# EAGLE design crass (EAGLE 7.3.0)
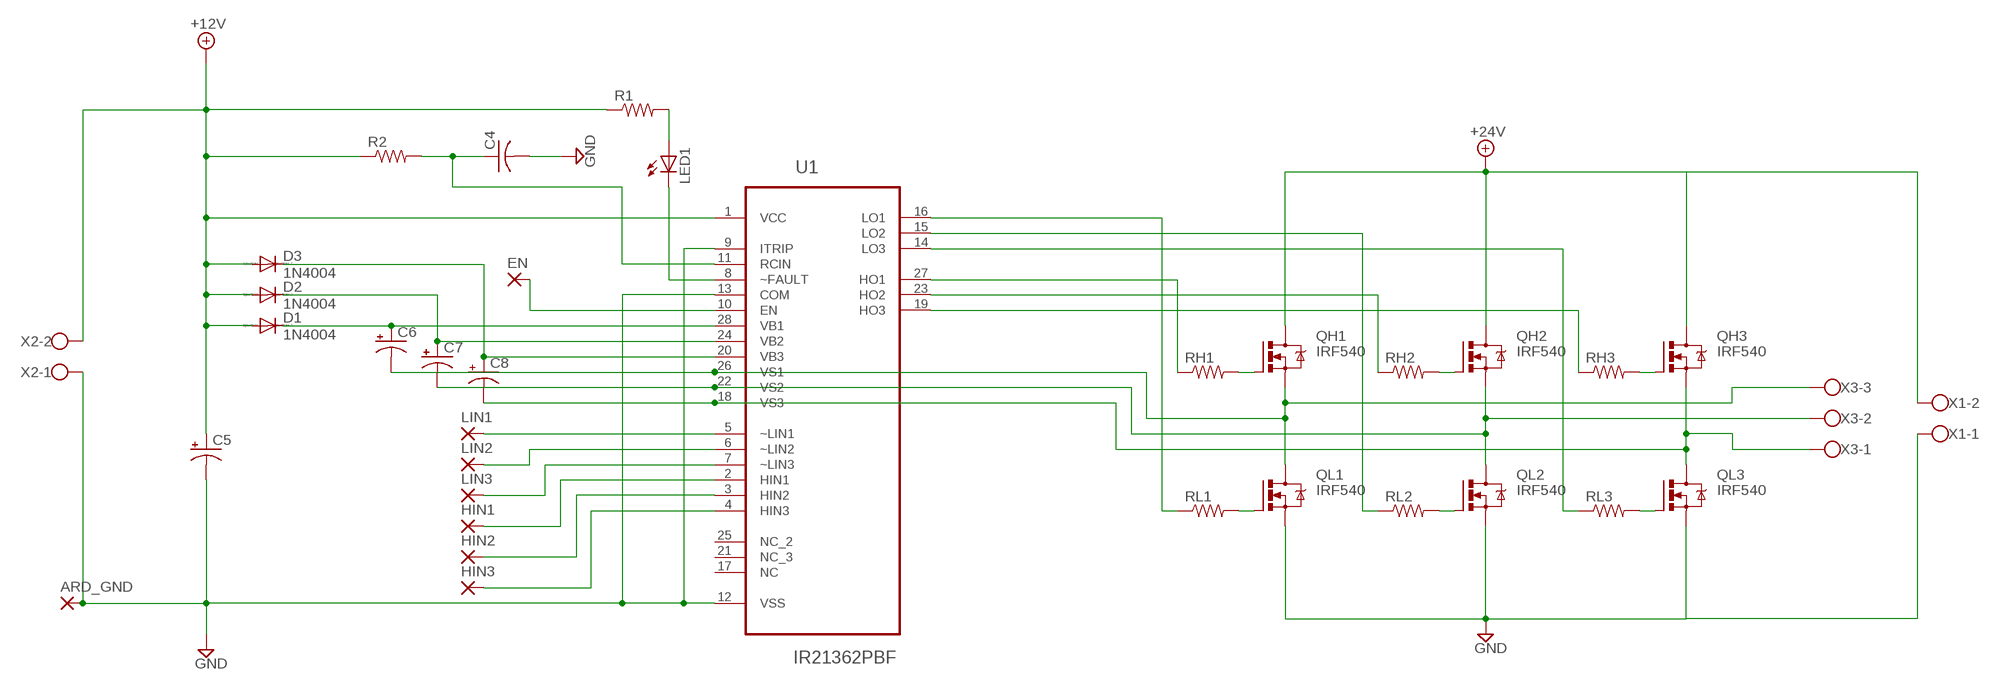
[diagram p0: schematic, sheet 1]

## Parts
ARD_GND  2,54/1,0  [2,54/1,0]
C4  C-US025-025X050  [C025-025X050]
C5  CPOL-USE2.5-7  [E2,5-7]
C6  CPOL-USE2.5-5  [E2,5-5]
C7  CPOL-USE2.5-5  [E2,5-5]
C8  CPOL-USE2.5-5  [E2,5-5]
D1  1N4004  [DO41-10]
D2  1N4004  [DO41-10]
D3  1N4004  [DO41-10]
EN  2,54/1,0  [2,54/1,0]
HIN1  2,54/1,0  [2,54/1,0]
HIN2  2,54/1,0  [2,54/1,0]
HIN3  2,54/1,0  [2,54/1,0]
LED1  LED5MM  [LED5MM]
LIN1  2,54/1,0  [2,54/1,0]
LIN2  2,54/1,0  [2,54/1,0]
LIN3  2,54/1,0  [2,54/1,0]
QH1  IRF540  [TO220BV]
QH2  IRF540  [TO220BV]
QH3  IRF540  [TO220BV]
QL1  IRF540  [TO220BV]
QL2  IRF540  [TO220BV]
QL3  IRF540  [TO220BV]
R1  R-US_0204/7  [0204/7]
R2  R-US_0204/7  [0204/7]
RH1  R-US_0204/7  [0204/7]
RH2  R-US_0204/7  [0204/7]
RH3  R-US_0204/7  [0204/7]
RL1  R-US_0204/7  [0204/7]
RL2  R-US_0204/7  [0204/7]
RL3  R-US_0204/7  [0204/7]
U1  IR21362PBF  [DIP254P1524X635-28]
X1  W237-102  [W237-102]
X2  W237-102  [W237-102]
X3  W237-103  [W237-103]

## Nets
+12V: C5.+ D1.A D2.A D3.A R1.1 R2.1 U1.1(VCC) X2.2
+24V: QH1.D QH2.D QH3.D X1.2
GND: ARD_GND.1(P) C4.2 C5.- QL1.S QL2.S QL3.S U1.9(ITRIP) U1.12(VSS) U1.13(COM) X1.1 X2.1
LIN2: LIN1.1(P) U1.5(~LIN1)
N$1: C6.+ D1.C U1.28(VB1)
N$2: C6.- QH1.S QL1.D U1.26(VS1) X3.3
N$3: C7.+ D2.C U1.24(VB2)
N$4: C7.- QH2.S QL2.D U1.22(VS2) X3.2
N$5: C8.+ D3.C U1.20(VB3)
N$6: C8.- QH3.S QL3.D U1.18(VS3) X3.1
N$7: QH1.G RH1.2
N$8: LED1.A R1.2
N$9: LED1.K(C) U1.8(~FAULT)
N$10: C4.1 R2.2 U1.11(RCIN)
N$11: QL1.G RL1.2
N$12: QH2.G RH2.2
N$13: QL2.G RL2.2
N$14: QH3.G RH3.2
N$15: QL3.G RL3.2
N$16: RH1.1 U1.27(HO1)
N$17: RL1.1 U1.16(LO1)
N$18: RH2.1 U1.23(HO2)
N$19: RH3.1 U1.19(HO3)
N$20: RL2.1 U1.15(LO2)
N$21: RL3.1 U1.14(LO3)
N$22: EN.1(P) U1.10(EN)
N$23: LIN2.1(P) U1.6(~LIN2)
N$24: LIN3.1(P) U1.7(~LIN3)
N$25: HIN1.1(P) U1.2(HIN1)
N$26: HIN2.1(P) U1.3(HIN2)
N$27: HIN3.1(P) U1.4(HIN3)
Unconnected: U1.17(NC) U1.21(NC_3) U1.25(NC_2)

## Library data of the parts
ARD_GND EN HIN1-HIN3 LIN1-LIN3 = wirepad:2,54/1,0: THROUGH-HOLE PAD
C4 = rcl:C-US: CAPACITOR, American symbol
C5-C8 = rcl:CPOL-US: POLARIZED CAPACITOR, American symbol
D1-D3 = diode:1N4004: DIODE general purpose rectifier, 1 A
LED1 = led:LED: LED OSRAM: - CHIPLED LG R971, LG N971, LY N971, LG Q971, LY Q971, LO R971, LY R971 LH N974, LH R974 LS Q976, LO Q976, LY Q976 LO Q996 - Hyper CHIPLED LW Q18S LB Q993, LB Q99A, LB R99A - SideLED LS A670, LO A670, LY A670, LG A670, LP A670 LB A673, LV A673, LT A673, LW A673 LH A674 LY A675 LS A676, LA A676, LO A676, LY A676, LW A676 LS A679, LY A679, LG A679 - Hyper Micro SIDELED® LS Y876, LA Y876, LO Y876, LY Y876 LT Y87S - SmartLED LW L88C, LW L88S LB L89C, LB L89S, LG L890 LS L89K, LO L89K, LY L89K LS L896, LA L896, LO L896, LY L896 - TOPLED LS T670, LO T670, LY T670, LG T670, LP T670 LSG T670, LSP T670, LSY T670, LOP T670, LYG T670 LG T671, LOG T671, LSG T671 LB T673, LV T673, LT T673, LW T673 LH T674 LS T676, LA T676, LO T676, LY T676, LB T676, LH T676, LSB T676, LW T676 LB T67C, LV T67C, LT T67C, LS T67K, LO T67K, LY T67K, LW E67C LS E67B, LA E67B, LO E67B, LY E67B, LB E67C, LV E67C, LT E67C LW T67C LS T679, LY T679, LG T679 LS T770, LO T770, LY T770, LG T770, LP T770 LB T773, LV T773, LT T773, LW T773 LH T774 LS E675, LA E675, LY E675, LS T675 LS T776, LA T776, LO T776, LY T776, LB T776 LHGB T686 LT T68C, LB T68C - Hyper Mini TOPLED® LB M676 - Mini TOPLED Santana® LG M470 LS M47K, LO M47K, LY M47K Source: http://www.osram.convergy.de LUXEON: - LUMILED® LXK2-PW12-R00, LXK2-PW12-S00, LXK2-PW14-U00, LXK2-PW14-V00 LXK2-PM12-R00, LXK2-PM12-S00, LXK2-PM14-U00 LXK2-PE12-Q00, LXK2-PE12-R00, LXK2-PE12-S00, LXK2-PE14-T00, LXK2-PE14-U00 LXK2-PB12-K00, LXK2-PB12-L00, LXK2-PB12-M00, LXK2-PB14-N00, LXK2-PB14-P00, LXK2-PB14-Q00 LXK2-PR12-L00, LXK2-PR12-M00, LXK2-PR14-Q00, LXK2-PR14-R00 LXK2-PD12-Q00, LXK2-PD12-R00, LXK2-PD12-S00 LXK2-PH12-R00, LXK2-PH12-S00 LXK2-PL12-P00, LXK2-PL12-Q00, LXK2-PL12-R00 Source: www.luxeon.com KINGBRIGHT: KA-3528ASYC Source: www.kingbright.com
QH1-QH3 QL1-QL3 = transistor-power:IRF540: HEXFET Power MOSFET
R1 R2 RH1-RH3 RL1-RL3 = rcl:R-US_: RESISTOR, American symbol
U1 = IR21362PBF:IR21362PBF: 3-PHASE BRIDGE DRIVER; MPN: IR21362PBF; OC_FARNELL: 1023217; OC_NEWARK: 33K5196; PACKAGE: PDIP-28; SUPPLIER: INTERNATIONAL RECTIFIER
X1 X2 = con-wago-500:W237-102: WAGO SCREW CLAMP; MPN: 237-102; OC_FARNELL: unknown; OC_NEWARK: 70K9898
X3 = con-wago-500:W237-103: WAGO SCREW CLAMP; MPN: 237-103; OC_FARNELL: unknown; OC_NEWARK: 18M7116

## Board
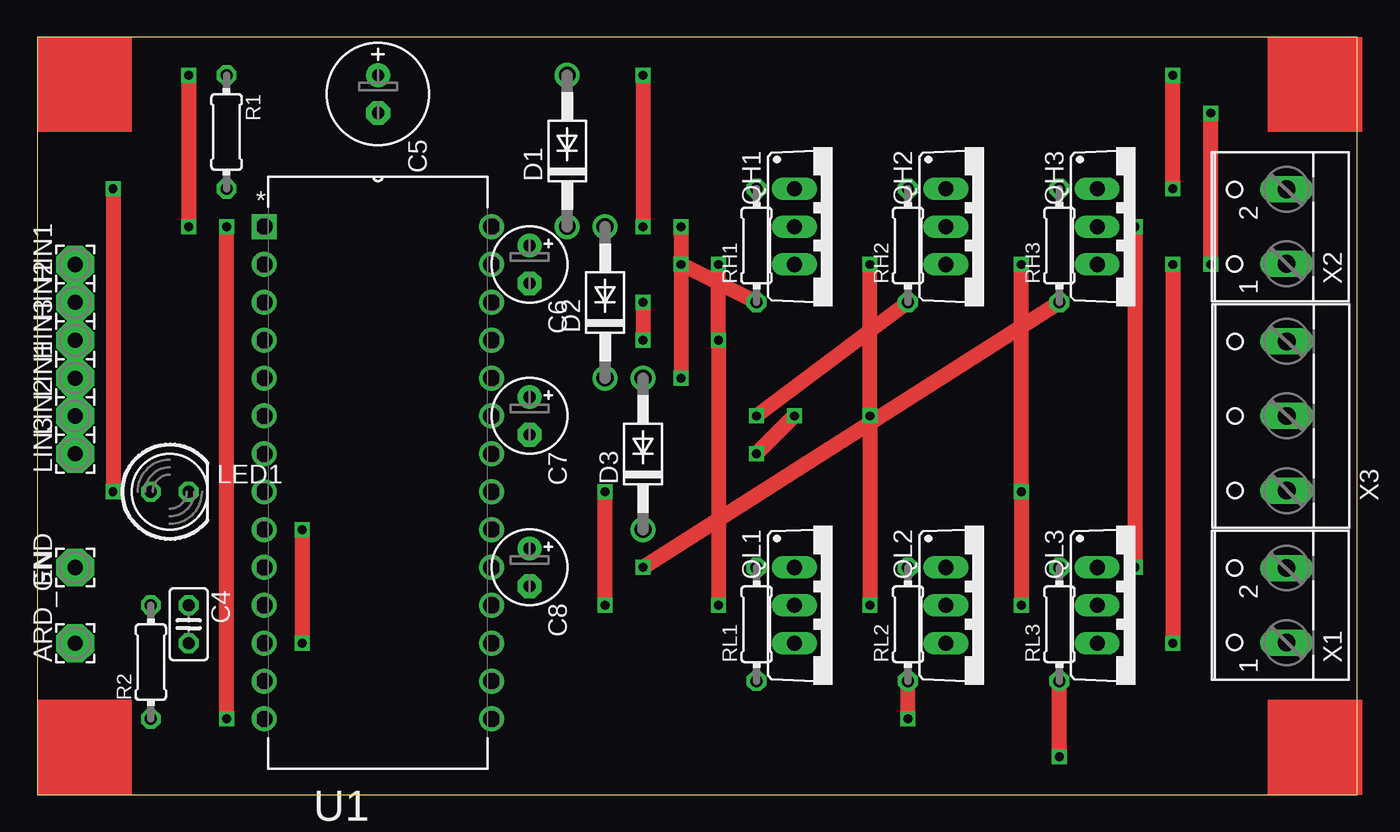
[diagram p1: board, top side]
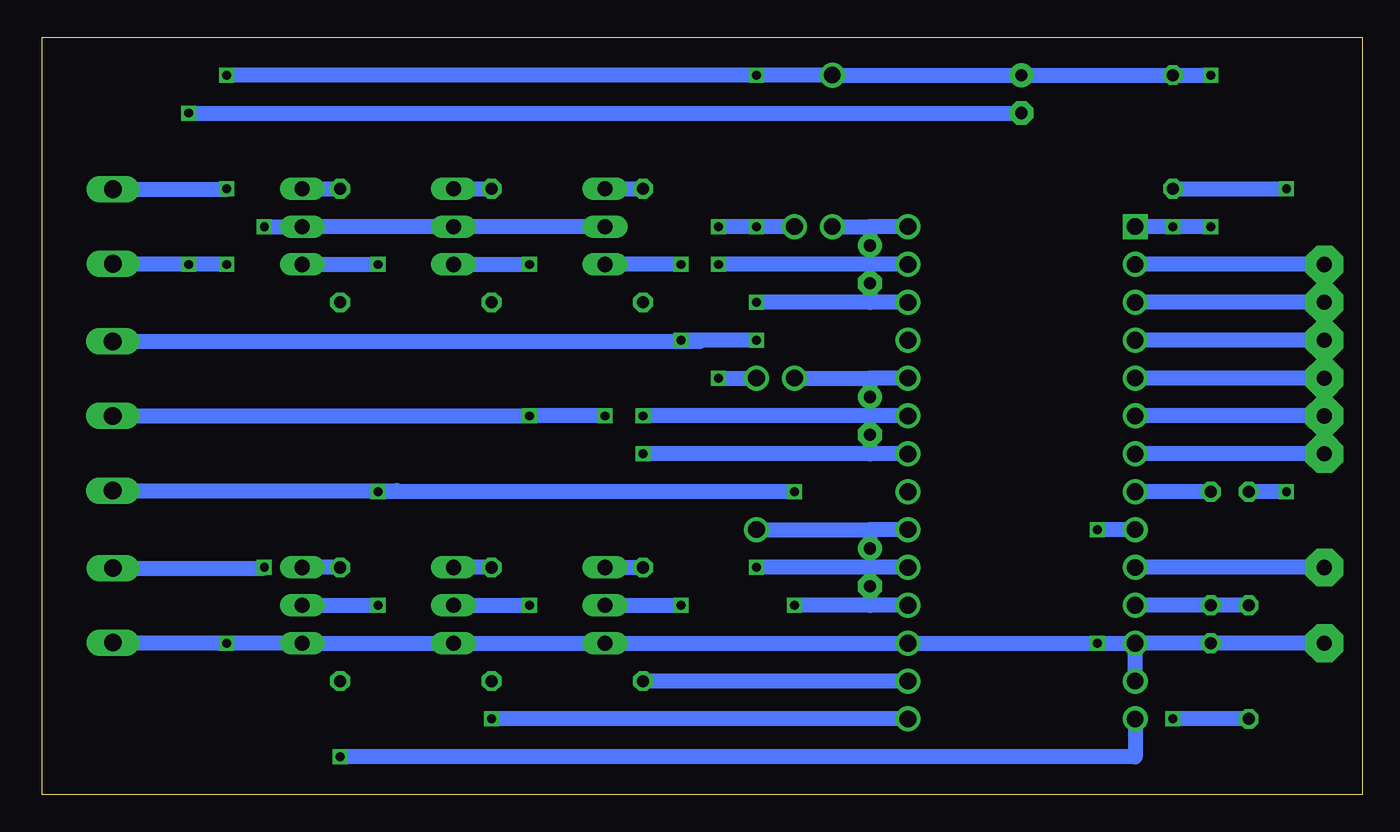
[diagram p2: board, bottom side, seen from below]

Size 88.57 x 50.79 mm. Coordinates in mm from the lower left corner, seen from the top.
Outline: 0,0 88.57,0 88.57,50.79 0,50.79 0,0
Copper layers (1*16): Top 0.035mm / dielectric 1.5mm / Bottom 0.035mm
Design rules "default": minimum track width 10mil, minimum drill 24mil, track to track 8mil, track to pad 8mil, pad to pad 8mil, via to via 8mil, smd to smd 8mil, copper to edge 40mil, drill to drill 8mil, minimum pad ring 10mil, minimum via ring 8mil, stop-mask expansion 4mil, vias tented up to drill 0mil, thermal gap 10mil

### Footprints (pad centres in the part's own frame; a part is rotated, then mirrored left to right if it is on the bottom)
2,54/1,0 = drill 1.016 pad 2.54 octagon: 1 0,0
C025-025X050 = drill 0.813 octagon: 1 -1.27,0; 2 1.27,0
E2,5-7 = drill 0.813 pad 1.6: + -1.27,0 | drill 0.813 pad 1.6 octagon: - 1.27,0
E2,5-5 = drill 0.813 pad 1.6: + -1.27,0 | drill 0.813 pad 1.6 octagon: - 1.27,0
DO41-10 = drill 1.118: A 5.08,0; C -5.08,0
LED5MM = drill 0.813 octagon: A -1.27,0; K 1.27,0
TO220BV = drill 1.016 long: D 0,-2.54; G -2.54,-2.54; S 2.54,-2.54
0204/7 = drill 0.813 octagon: 1 -3.81,0; 2 3.81,0
DIP254P1524X635-28 = drill 1.118 square: 1 -15.24,33.02 | drill 1.118: 2 -15.24,30.48; 3 -15.24,27.94; 4 -15.24,25.4; 5 -15.24,22.86; 6 -15.24,20.32; 7 -15.24,17.78; 8 -15.24,15.24; 9 -15.24,12.7; 10 -15.24,10.16; 11 -15.24,7.62; 12 -15.24,5.08; 13 -15.24,2.54; 14 -15.24,0; 15 0,0; 16 0,2.54; 17 0,5.08; 18 0,7.62; 19 0,10.16; 20 0,12.7; 21 0,15.24; 22 0,17.78; 23 0,20.32; 24 0,22.86; 25 0,25.4; 26 0,27.94; 27 0,30.48; 28 0,33.02
W237-102 = drill 1.194 long: 1 -2.5,-1.27; 2 2.5,-1.27
W237-103 = drill 1.194 long: 1 -5,-1.29; 2 0,-1.29; 3 5,-1.29

### Placement (x,y rotation side)
ARD_GND  2.54,10.16 90 top
C4  10.16,11.43 270 top
C5  22.86,46.99 270 top
C6  33.02,35.56 270 top
C7  33.02,25.4 270 top
C8  33.02,15.24 270 top
D1  35.56,43.18 90 top
D2  38.1,33.02 90 top
D3  40.64,22.86 90 top
EN  2.54,15.24 90 top
HIN1  2.54,35.56 90 top
HIN2  2.54,33.02 90 top
HIN3  2.54,30.48 90 top
LED1  8.89,20.32 0 top
LIN1  2.54,27.94 90 top
LIN2  2.54,25.4 90 top
LIN3  2.54,22.86 90 top
QH1  53.34,38.1 270 top
QH2  63.5,38.1 270 top
QH3  73.66,38.1 270 top
QL1  53.34,12.7 270 top
QL2  63.5,12.7 270 top
QL3  73.66,12.7 270 top
R1  12.7,44.45 270 top
R2  7.62,8.89 90 top
RH1  48.26,36.83 90 top
RH2  58.42,36.83 90 top
RH3  68.58,36.83 90 top
RL1  48.26,11.43 90 top
RL2  58.42,11.43 90 top
RL3  68.58,11.43 90 top
U1  30.48,5.08 0 top
X1  82.55,12.7 90 top
X2  82.55,38.1 90 top
X3  82.55,25.4 90 top

### Tracks (layer width: path | path; a pad name or v marks a point on that pad's centre or on a via)
+12V  (via drill 0.6)
  Top 1.016: v76.2,40.64 v76.2,48.26 | v10.16,48.26 v10.16,38.1 | v12.7,5.08 v12.7,38.1 | v40.64,48.26 v40.64,38.1 | v43.18,38.1 v43.18,27.94
  Bottom 1.016: X2.2 76.2,40.6 v76.2,40.64 | v10.16,48.26 R1.1 C5.+ D1.A v40.64,48.26 v76.2,48.26 | v10.16,38.1 v12.7,38.1 U1.1 | R2.1 v12.7,5.08 | D2.A v40.64,38.1 v43.18,38.1 | v43.18,27.94 D3.A
+24V  (via drill 0.6)
  Top 1.016: v73.66,15.24 v73.66,38.1
  Bottom 1.016: QH1.D QH2.D QH3.D v73.66,38.1 | X1.2 73.66,15.2 v73.66,15.24
GND  (via drill 0.6)
  Top 1.016: v76.2,35.56 v76.2,10.16 | v78.74,35.56 v78.74,45.72 | v17.78,17.78 v17.78,10.16
  Bottom 1.016: U1.12 v17.78,10.16 QL1.S QL2.S QL3.S v76.2,10.16 82.55,10.16 X1.1 | U1.13 U1.12 | ARD_GND.1 C4.2 U1.12 | X2.1 78.74,35.6 v78.74,35.56 v76.2,35.56 | v78.74,45.72 C5.- | U1.9 v17.78,17.78
LIN2
  Bottom 1.016: LIN1.1 U1.5
N$1
  Bottom 1.016: U1.28 33.02,38.1 | 33.02,38.1 C6.+ | D1.C 33.02,38.1
N$2  (via drill 0.6)
  Top 1.016: v45.72,35.56 v45.72,30.48 v45.72,12.7 | v40.64,33.02 v40.64,30.48
  Bottom 1.016: v45.72,35.56 QH1.S | QL1.D v45.72,12.7 | U1.26 33.02,33.02 | 33.02,33.02 v40.64,33.02 | v40.64,30.48 v45.72,30.48 44.45,30.4 X3.3 | C6.- 33.02,33.02
N$3  (via drill 0.6)
  Bottom 1.016: U1.24 33.02,27.94 | 33.02,27.94 C7.+ | D2.C 33.02,27.94
  other vias: 38.1,27.94
N$4  (via drill 0.6)
  Top 1.016: v55.88,35.56 v55.88,25.4 v55.88,12.7 | v48.26,22.86 v50.8,25.4
  Bottom 1.016: QH2.S v55.88,35.56 | QL2.D v55.88,12.7 | U1.22 33.02,22.86 | 33.02,22.86 v48.26,22.86 | v50.8,25.4 v55.88,25.4 X3.2 | C7.- 33.02,22.86
N$5  (via drill 0.6)
  Bottom 1.016: U1.20 33.02,17.78 | 33.02,17.78 C8.+ | D3.C 33.02,17.78
  other vias: 40.64,17.78
N$6  (via drill 0.6)
  Top 1.016: v66.04,35.56 v66.04,20.32 v66.04,12.7 | v38.1,12.7 v38.1,20.32
  Bottom 1.016: QH3.S v66.04,35.56 | QL3.D v66.04,12.7 | U1.18 33.02,12.7 | 33.02,12.7 v38.1,12.7 | v38.1,20.32 v66.04,20.32 64.77,20.4 X3.1 | C8.- 33.02,12.7
N$7
  Bottom 1.016: QH1.G RH1.2
N$8  (via drill 0.6)
  Top 1.016: v5.08,40.64 v5.08,20.32
  Bottom 1.016: R1.2 v5.08,40.64 | v5.08,20.32 LED1.A
N$9
  Bottom 1.016: LED1.K U1.8
N$10
  Bottom 1.016: R2.2 C4.1 U1.11
N$11
  Bottom 1.016: QL1.G RL1.2
N$12
  Bottom 1.016: QH2.G RH2.2
N$13
  Bottom 1.016: RL2.2 QL2.G
N$14
  Bottom 1.016: QH3.G RH3.2
N$15
  Bottom 1.016: RL3.2 QL3.G
N$16  (via drill 0.6)
  Top 1.016: v43.18,35.56 RH1.1
  Bottom 1.016: U1.27 v43.18,35.56
N$17
  Bottom 1.016: U1.16 RL1.1
N$18  (via drill 0.6)
  Top 1.016: v48.26,25.4 RH2.1
  Bottom 1.016: U1.23 v48.26,25.4
N$19  (via drill 0.6)
  Top 1.016: v40.64,15.24 RH3.1
  Bottom 1.016: U1.19 v40.64,15.24
N$20  (via drill 0.6)
  Top 1.016: v58.42,5.08 RL2.1
  Bottom 1.016: U1.15 v58.42,5.08
N$21  (via drill 0.6)
  Top 1.016: v68.58,2.54 RL3.1
  Bottom 1.016: U1.14 15.24,2.54 v68.58,2.54
N$22
  Bottom 1.016: EN.1 U1.10
N$23
  Bottom 1.016: LIN2.1 U1.6
N$24
  Bottom 1.016: LIN3.1 U1.7
N$25
  Bottom 1.016: HIN1.1 U1.2
N$26
  Bottom 1.016: HIN2.1 U1.3
N$27
  Bottom 1.016: HIN3.1 U1.4
(copper drawn outside any net)
  shapes: Top area x4